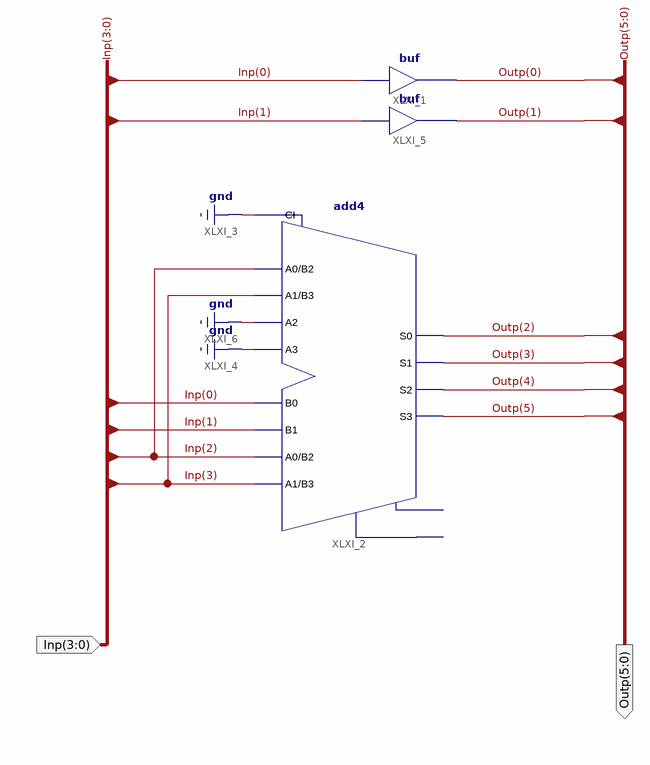
[diagram p0: schematic sheet 1]
// Xilinx ISE schematic Multiply_4Bit_5.sch (spartan3e) as structural Verilog: 3 symbols, 2 ports
module Multiply_4Bit_5 (
  input  [3:0] Inp,
  output [5:0] Outp
);

  buf XLXI_1 (Outp[0], Inp[0]);
  add4 XLXI_2 (
    .A0(Inp[2]), .A1(Inp[3]), .A2(1'b0), .A3(1'b0), .B0(Inp[0]), .B1(Inp[1]), .B2(Inp[2]), .B3(Inp[3]),
    .CI(1'b0), .S0(Outp[2]), .S1(Outp[3]), .S2(Outp[4]), .S3(Outp[5]));  // open: CO, OFL
  buf XLXI_5 (Outp[1], Inp[1]);
endmodule
